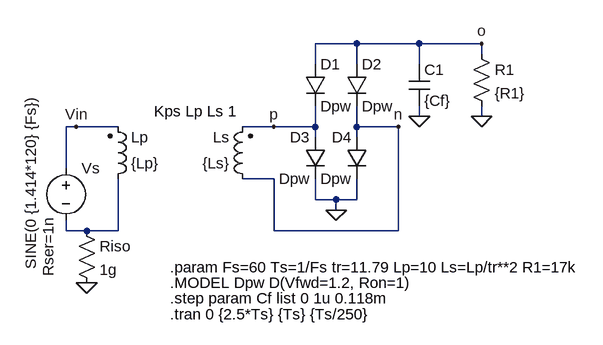
[diagram p0: schematic 9-2-3-a-1.asc]
9-2-3-a-1.asc, the LTspice schematic file:
Version 4
SHEET 1 880 680
WIRE 416 -128 352 -128
WIRE 512 -128 416 -128
WIRE 608 -128 512 -128
WIRE 608 -112 608 -128
WIRE 352 -96 352 -128
WIRE 416 -96 416 -128
WIRE 512 -96 512 -128
WIRE 512 -16 512 -32
WIRE 608 -16 608 -32
WIRE -16 0 -32 0
WIRE 48 0 -16 0
WIRE 288 0 240 0
WIRE 352 0 352 -32
WIRE 352 0 288 0
WIRE 416 0 416 -32
WIRE 480 0 416 0
WIRE 352 16 352 0
WIRE 416 16 416 0
WIRE -32 64 -32 0
WIRE 288 80 240 80
WIRE 352 112 352 80
WIRE 384 112 352 112
WIRE 416 112 416 80
WIRE 416 112 384 112
WIRE 384 128 384 112
WIRE -32 160 -32 144
WIRE 0 160 -32 160
WIRE 48 160 48 80
WIRE 48 160 0 160
WIRE 288 160 288 80
WIRE 480 160 480 0
WIRE 480 160 288 160
FLAG 384 128 0
FLAG 512 -16 0
FLAG 608 -16 0
FLAG 288 0 p
FLAG 480 0 n
FLAG -16 0 Vin
FLAG 0 240 0
FLAG 608 -128 o
SYMBOL voltage -32 48 R0
WINDOW 123 0 0 Left 0
WINDOW 39 -27 90 VRight 2
WINDOW 3 -54 -98 VRight 2
SYMATTR SpiceLine Rser=1n
SYMATTR InstName Vs
SYMATTR Value SINE(0 {1.414*120} {Fs})
SYMBOL ind2 32 96 M180
WINDOW 0 36 80 Left 2
WINDOW 3 36 40 Left 2
SYMATTR InstName Lp
SYMATTR Value {Lp}
SYMATTR Type ind
SYMBOL ind2 256 96 R180
WINDOW 0 36 80 Left 2
WINDOW 3 36 40 Left 2
SYMATTR InstName Ls
SYMATTR Value {Ls}
SYMATTR Type ind
SYMBOL diode 336 -96 R0
SYMATTR InstName D1
SYMATTR Value Dpw
SYMBOL diode 400 -96 R0
SYMATTR InstName D2
SYMATTR Value Dpw
SYMBOL diode 368 16 M0
SYMATTR InstName D3
SYMATTR Value Dpw
SYMBOL diode 432 16 M0
SYMATTR InstName D4
SYMATTR Value Dpw
SYMBOL res 592 -128 R0
SYMATTR InstName R1
SYMATTR Value {R1}
SYMBOL cap 496 -96 R0
SYMATTR InstName C1
SYMATTR Value {Cf}
SYMBOL res -16 144 R0
SYMATTR InstName Riso
SYMATTR Value 1g
TEXT 128 216 Left 2 !.param Fs=60 Ts=1/Fs tr=11.79 Lp=10 Ls=Lp/tr**2 R1=17k
TEXT 128 240 Left 2 !.MODEL Dpw D(Vfwd=1.2, Ron=1)
TEXT 104 -24 Left 2 !Kps Lp Ls 1
TEXT 128 264 Left 2 !.step param Cf list 0 1u 0.118m
TEXT 128 288 Left 2 !.tran 0 {2.5*Ts} {Ts} {Ts/250}

The netlist it stands for:
* 9-2-3-a-1.asc
Vs Vin N001 SINE(0 {1.414*120} {Fs}) Rser=1n
Lp N001 Vin {Lp}
Ls n p {Ls}
D1 o p Dpw
D2 o n Dpw
D3 p 0 Dpw
D4 n 0 Dpw
R1 o 0 {R1}
C1 o 0 {Cf}
Riso N001 0 1g
.model D D
.lib standard.dio
.param Fs=60 Ts=1/Fs tr=11.79 Lp=10 Ls=Lp/tr**2 R1=17k
.MODEL Dpw D(Vfwd=1.2, Ron=1)
Kps Lp Ls 1
.step param Cf list 0 1u 0.118m
.tran 0 {2.5*Ts} {Ts} {Ts/250}
.backanno
.end

* Results of the author's LTspice run, read from the files saved beside the schematic
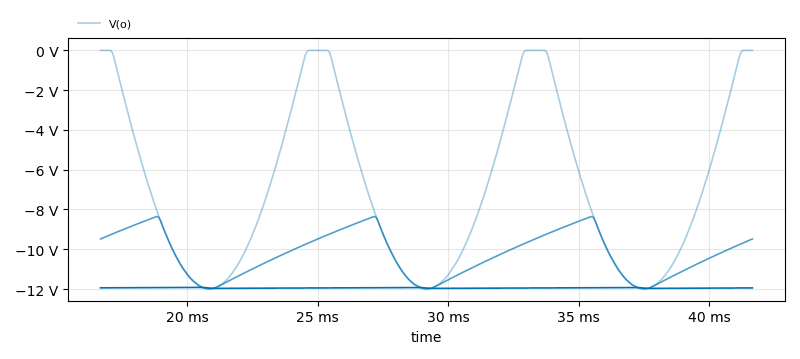
[diagram p1: Transient Analysis of 9-2-3-a-1.asc, plotted from the saved traces]
* Transient Analysis, 3 runs:
*   V(o) [run 1]: min -11.99 V, max 0 V, average -6.887 V, rms 8.067 V, last 0 V
*   V(o) [run 2]: min -11.99 V, max -8.353 V, average -10.24 V, rms 10.31 V, last -9.481 V
*   V(o) [run 3]: min -11.97 V, max -11.92 V, average -11.94 V, rms 11.94 V, last -11.94 V